# EAGLE design RJ10 (EAGLE 9.4.2)
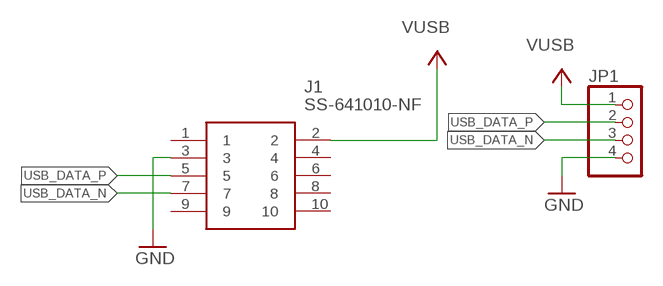
[diagram p0: schematic, sheet 1]

## Parts
J1  SS-641010-NF  [SS-641010-NF]
JP1  PINHD-1X4  [1X04]

## Nets
GND: J1.3 JP1.4
USB_DATA_N: J1.7 JP1.3
USB_DATA_P: J1.5 JP1.2
VUSB: J1.2 JP1.1
Unconnected: J1.1 J1.4 J1.6 J1.8 J1.9 J1.10

## Library data of the parts
J1 = SS-641010-NF:SS-641010-NF: Bel-Stewart 10P10C Right Angle RJ50 Connector, Through Hole Source: Datasheet <http://uk.rs-online.com/web/p/products/0442735>; DESCRIPTION: Bel-Stewart 10P10C Right Angle RJ50 Connector, Through Hole; HEIGHT: mm; MANUFACTURER_NAME: Bel-Stewart; MANUFACTURER_PART_NUMBER: SS-641010-NF; MOUSER_PART_NUMBER: 530-SS-641010-NF; MOUSER_PRICE-STOCK: https://www.mouser.com/Search/Refine.aspx?Keyword=530-SS-641010-NF
JP1 = pinhead:PINHD-1X4: PIN HEADER

## Board
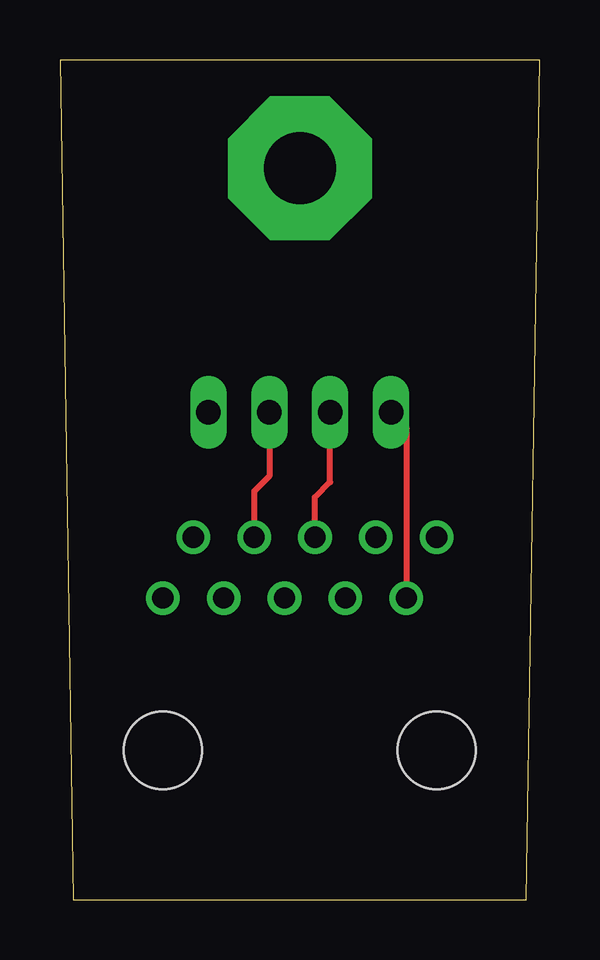
[diagram p1: board, top side]
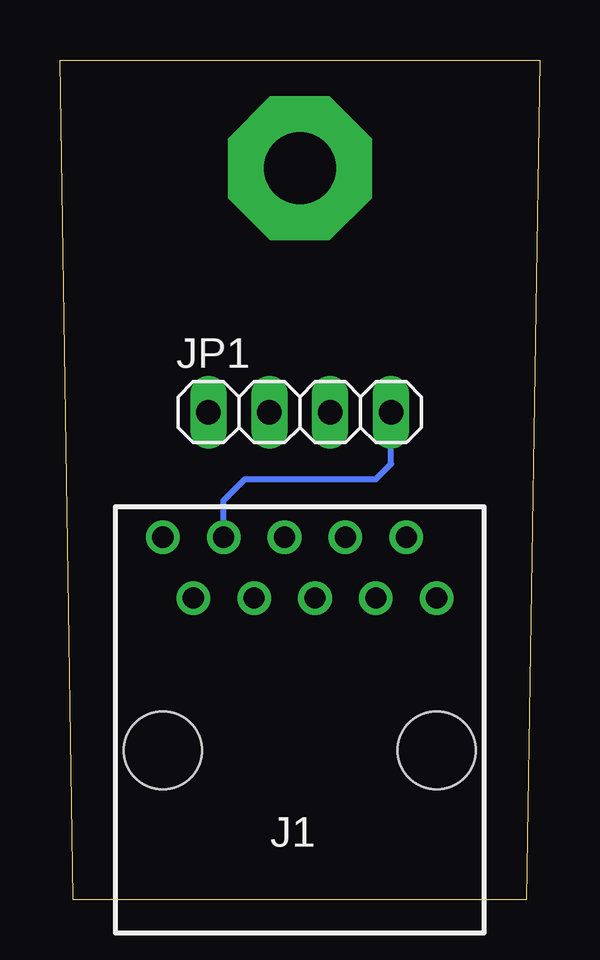
[diagram p2: board, bottom side, seen from below]

Size 20 x 35 mm. Coordinates in mm from the lower left corner, seen from the top.
Outline: 0.55,0 19.45,0 20,35 0,35 0.55,0
Copper layers (1*16): Top 0.035mm / dielectric 1.5mm / Bottom 0.035mm
Design rules "default": minimum track width 10mil, minimum drill 24mil, track to track 8mil, track to pad 8mil, pad to pad 8mil, via to via 8mil, smd to smd 8mil, copper to edge 40mil, drill to drill 8mil, minimum pad ring 10mil, minimum via ring 8mil, stop-mask expansion 4mil, vias tented up to drill 0mil, thermal gap 10mil

### Footprints (pad centres in the part's own frame; a part is rotated, then mirrored left to right if it is on the bottom)
SS-641010-NF = drill 0.89 pad 1.39: 1 -5.715,16.51; 2 -4.445,13.97; 3 -3.175,16.51; 4 -1.905,13.97; 5 -0.635,16.51; 6 0.635,13.97; 7 1.905,16.51; 8 3.175,13.97; 9 4.445,16.51; 10 5.715,13.97 | hole 3.25: 5.715,7.62; -5.715,7.62
1X04 = drill 1.016 long: 1 -3.81,0; 2 -1.27,0; 3 1.27,0; 4 3.81,0

### Placement (x,y rotation side)
J1  10,-1.4 0 bottom
JP1  10,20.32 0 bottom

### Tracks (layer width: path | path; a pad name or v marks a point on that pad's centre or on a via)
GND
  Bottom 0.254: J1.3 13.18,16.64 12.29,17.53 6.83,17.53 6.19,18.16 JP1.4
N$1  (via drill 3 pad 6)
  other vias: 10,30.48
USB_DATA_N
  Top 0.254: JP1.3 8.73,17.65 8.1,17.02 J1.7
USB_DATA_P
  Top 0.254: J1.5 10.63,16.76 11.27,17.4 JP1.2
VUSB
  Top 0.254: JP1.1 14.45,19.68 J1.2